# Altium schematic sheet PLBank35.SchDoc
size A4; SheetNumber: 12; SheetTotal: 18
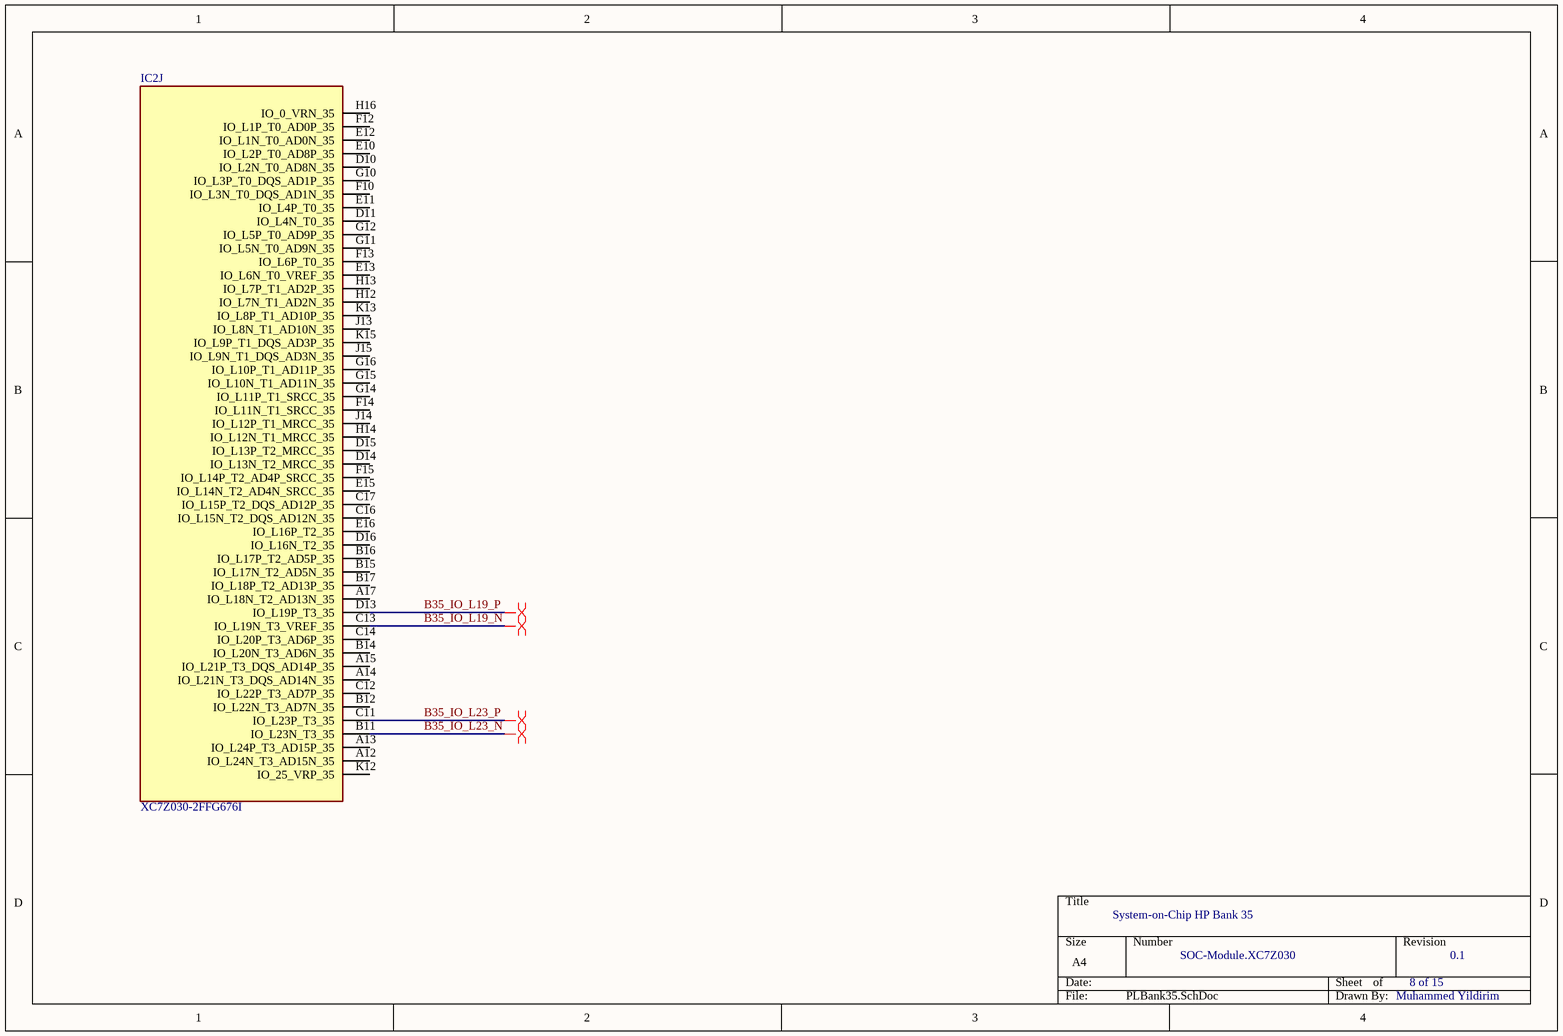
[diagram p0: PLBank35.SchDoc]

## Parts
IC2  XC7Z030-2FFG676I  [BGA676C100P26X26_2700X2700X324]  (part J of 15)

## Nets
B35_IO_L19_N: IC2.C13(IO_L19N_T3_VREF_35)
B35_IO_L19_P: IC2.D13(IO_L19P_T3_35)
B35_IO_L23_N: IC2.B11(IO_L23N_T3_35)
B35_IO_L23_P: IC2.C11(IO_L23P_T3_35)

Not connected (* = marked no-connect by the designer): IC2 A12(IO_L24N_T3_AD15N_35) A13(IO_L24P_T3_AD15P_35) A14(IO_L21N_T3_DQS_AD14N_35) A15(IO_L21P_T3_DQS_AD14P_35) A17(IO_L18N_T2_AD13N_35) B12(IO_L22N_T3_AD7N_35) B14(IO_L20N_T3_AD6N_35) B15(IO_L17N_T2_AD5N_35) B16(IO_L17P_T2_AD5P_35) B17(IO_L18P_T2_AD13P_35) C12(IO_L22P_T3_AD7P_35) C14(IO_L20P_T3_AD6P_35) C16(IO_L15N_T2_DQS_AD12N_35) C17(IO_L15P_T2_DQS_AD12P_35) D10(IO_L2N_T0_AD8N_35) D11(IO_L4N_T0_35) D14(IO_L13N_T2_MRCC_35) D15(IO_L13P_T2_MRCC_35) D16(IO_L16N_T2_35) E10(IO_L2P_T0_AD8P_35) E11(IO_L4P_T0_35) E12(IO_L1N_T0_AD0N_35) E13(IO_L6N_T0_VREF_35) E15(IO_L14N_T2_AD4N_SRCC_35) E16(IO_L16P_T2_35) F10(IO_L3N_T0_DQS_AD1N_35) F12(IO_L1P_T0_AD0P_35) F13(IO_L6P_T0_35) F14(IO_L11N_T1_SRCC_35) F15(IO_L14P_T2_AD4P_SRCC_35) G10(IO_L3P_T0_DQS_AD1P_35) G11(IO_L5N_T0_AD9N_35) G12(IO_L5P_T0_AD9P_35) G14(IO_L11P_T1_SRCC_35) G15(IO_L10N_T1_AD11N_35) G16(IO_L10P_T1_AD11P_35) H12(IO_L7N_T1_AD2N_35) H13(IO_L7P_T1_AD2P_35) H14(IO_L12N_T1_MRCC_35) H16(IO_0_VRN_35) J13(IO_L8N_T1_AD10N_35) J14(IO_L12P_T1_MRCC_35) J15(IO_L9N_T1_DQS_AD3N_35) K12(IO_25_VRP_35) K13(IO_L8P_T1_AD10P_35) K15(IO_L9P_T1_DQS_AD3P_35)

## Layout directives
differential pair: B35_IO_L19_N, B35_IO_L19_P, B35_IO_L23_N, B35_IO_L23_P

## Notes on the sheet
- System-on-Chip HP Bank 35
- SOC-Module.XC7Z030
- 8 of 15
- 0.1
- Muhammed Yildirim

## Library data of the parts
IC2 = XC7Z030-2FFG676I: Integrated Circuit; Manufacturer_Name: AMD; Datasheet Link: http://www.xilinx.com/support/documentation/data_sheets/ds190-Zynq-7000-Overview.pdf; Height: 3.24mm; Manufacturer_Part_Number: XC7Z030-2FFG676I; Mouser Part Number: 217-XC7Z030-2FFG676I; Mouser Price/Stock: https://www.mouser.co.uk/ProductDetail/Xilinx/XC7Z030-2FFG676I?qs=rrS6PyfT74cuZK5O3CSpmw%3D%3D